# EasyEDA Pro project Trinity Flight Computer_2025-07-16.epro

# Schematic Trinity Schematic
Board Name: Board1; Create Date: 2025-04-18; Page Name: Main; Project Name: Trinity Flight Computer; Schematic Name: Trinity Schematic; Update Date: 2025-04-29; Company: Space Force; Drawn: Tadeáš Těhan; Page Size: A4; Version: V1.0
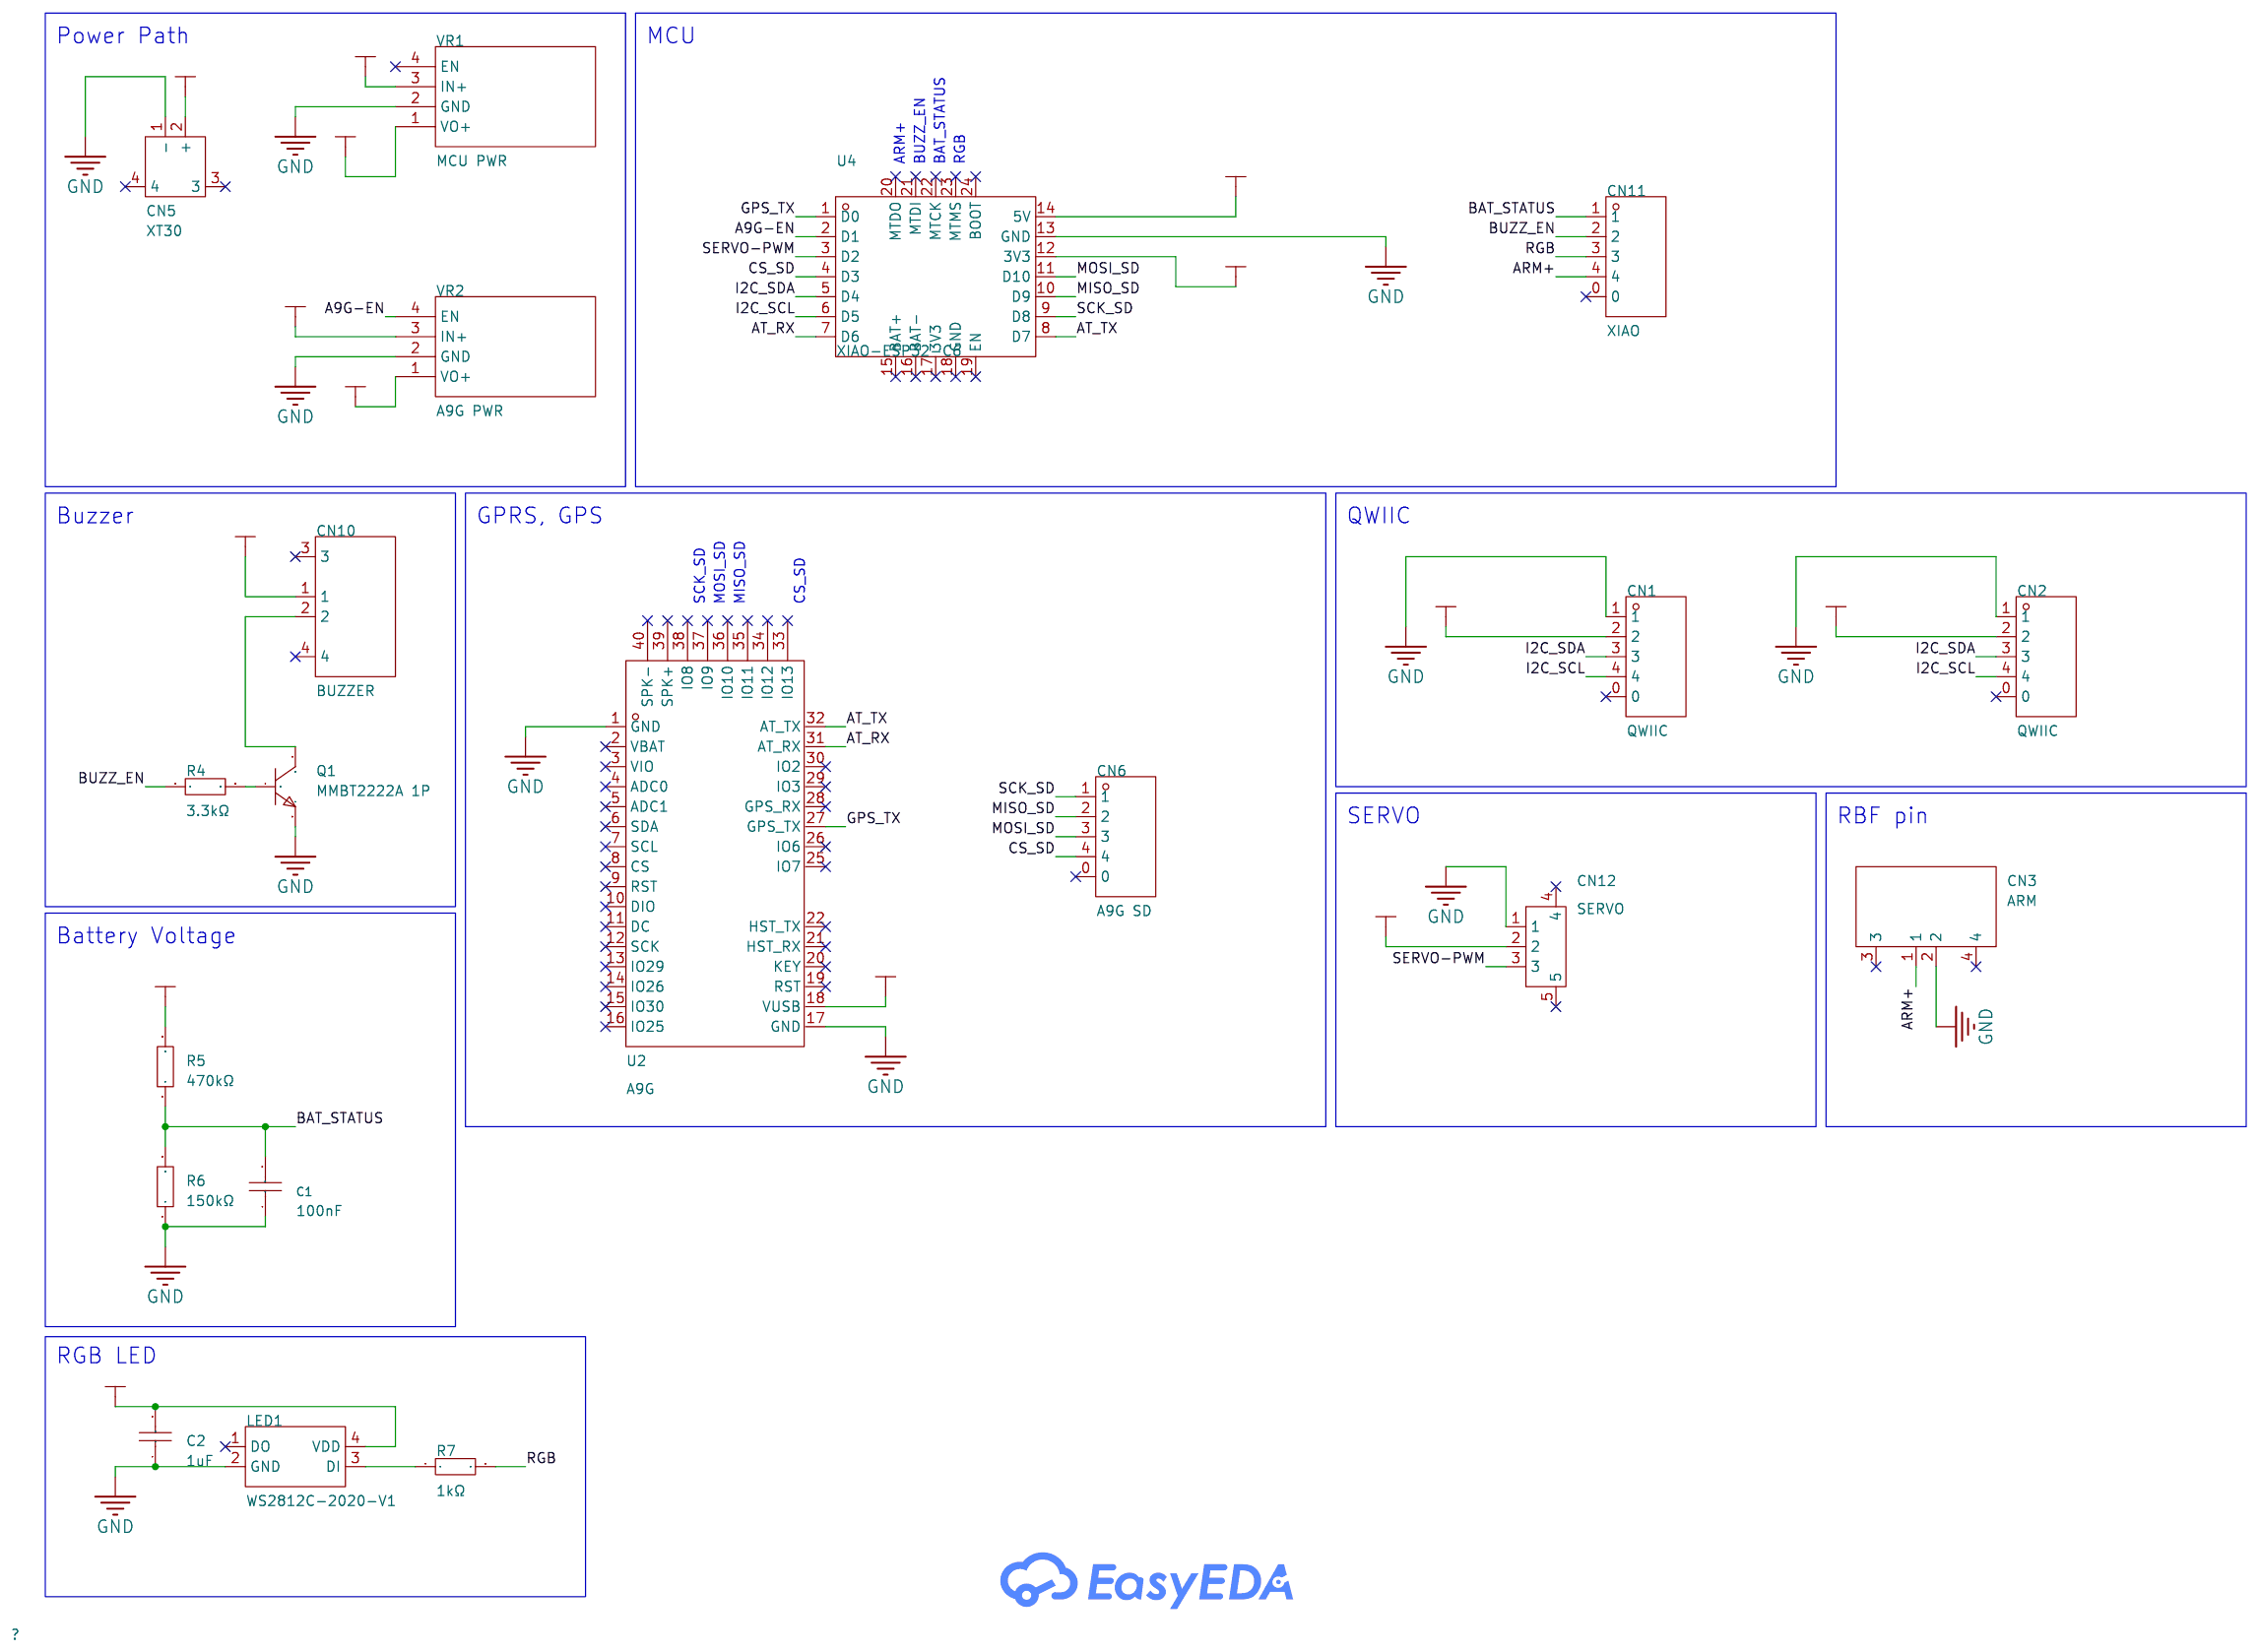
[diagram p0: schematic sheet]

## Parts
C1  100nF  [C0603]
C2  1uF  [C0603]
CN1  QWIIC  [CONN-SMD_BM04B-SRSS-TB]
CN2  QWIIC  [CONN-SMD_BM04B-SRSS-TB]
CN3  ARM  [CONN-TH_BM02B-SRSS-TB-LF-SN]
CN5  XT30  [CONN-TH_XT30PW-M]
CN6  A9G SD  [CONN-SMD_BM04B-SRSS-TB]
CN10  BUZZER  [CONN-TH_BM02B-SRSS-TB-LF-SN]
CN11  XIAO  [CONN-SMD_BM04B-SRSS-TB]
CN12  SERVO  [CONN-SMD_BM03B-SRSS-TBT-LF-SN]
LED1  WS2812C-2020-V1  [LED-SMD_4P-L2.0-W2.0-TL_WS2812B-2020]
Q1  MMBT2222A 1P  [SOT-23-3_L2.9-W1.3-P1.90-LS2.4-BR]
R4  3.3kΩ  [R0603]
R5  470kΩ  [R0603]
R6  150kΩ  [R0603]
R7  1kΩ  [R0603]
U2  A9G  [COMM-TH_A9G-MODULE]
U4  XIAO-ESP32-C6  [XIAO-ESP32-C6]
VR1  MCU PWR  [MP2315]
VR2  A9G PWR  [MP2315]

## Library data of the parts
C1 = 0603B104K250CT_C83054: Capacitance: Tolerance:±10% Tolerance:±10% Voltage Rated: Temperature Coefficient:; LCSC Part Name: 100nF ±10% 25V; Supplier Part: C83054; Manufacturer: Walsin(华新科); Manufacturer Part: 0603B104K250CT; Supplier Footprint: 0603; JLCPCB Part Class: Extended Part; Datasheet: https://atta.szlcsc.com/upload/public/pdf/source/20161123/1479873081754.pdf; Supplier: LCSC; Tolerance: ±10%
C2 = 0603B105K160CT: Capacitance: Tolerance:±10% Tolerance:±10% Voltage Rated: Temperature Coefficient:; LCSC Part Name: 1uF ±10% 16V; Supplier Part: C108463; Manufacturer: Walsin(华新科); Supplier Footprint: 0603; JLCPCB Part Class: Extended Part; Datasheet: https://atta.szlcsc.com/upload/public/pdf/source/20240116/5FE9141A208209FD572C22A50E54F9EC.pdf; Supplier: LCSC; Tolerance: ±10%
CN1 CN2 CN6 CN11 = BM04B-SRSS-TB(LF)(SN): Pins Structure:1x4P Pitch:1mm Mounting Style:Standing paste Reference Series:SH Number of Pins:4P Number of Rows:1 Number of PINs Per Row:4 Row Spacing:- Current Rating (Max):1A Contact Material:Copper alloy Contact Plating:Tin Operating Temperature Range; LCSC Part Name: 1x4P 间距:1mm 立贴 系列:SH; Supplier Part: C160390; Manufacturer: JST; Supplier Footprint: SMD,P=1mm; JLCPCB Part Class: Extended Part; Datasheet: https://atta.szlcsc.com/upload/public/pdf/source/20181008/C268118_5C0FE2784716D1E5DD0A36233D1E1F34.pdf; Supplier: LCSC; Pins Structure: 1x4P; Pitch: 1mm; Mounting Style: Standing paste; Reference Series: SH; Number of Pins: 4P; Number of Rows: 1; Number of PINs Per Row: 4; Current Rating (Max): 1A; Contact Material: Copper alloy; Contact Plating: Tin; Operating Temperature Range: -25℃~+85℃; Rated Voltage (Max): 50V; Plastic Material: PA; Flame Retardant Rating: UL94V-0; Supplementary Features: Auxiliary soldering legs; Colour: White; Z-Height of the Board: 4.25mm; X-Length of Bottom Edge on Board (Spacing Line): 6mm; Y-Width of Bottom Edge on Board: 3.6mm
CN3 CN10 = BM02B-SRSS-TB(LF)(SN): Pins Structure:1x2P Pitch:1mm Mounting Style:Brick nogging Reference Series:SH Number of Pins:2P Number of Rows:1 Number of PINs Per Row:2 Row Spacing:- Current Rating (Max):1A Contact Material:Copper Alloy Contact Plating:Tin Operating Temperature Range:; LCSC Part Name: 1x2P 间距:1mm 立贴 系列:SH; Supplier Part: C160388; Manufacturer: JST; Supplier Footprint: SMD,P=1mm; JLCPCB Part Class: Extended Part; Datasheet: https://atta.szlcsc.com/upload/public/pdf/source/20181008/C268118_5C0FE2784716D1E5DD0A36233D1E1F34.pdf; Supplier: LCSC; Pins Structure: 1x2P; Pitch: 1mm; Mounting Style: Brick nogging; Reference Series: SH; Number of Pins: 2P; Number of Rows: 1; Number of PINs Per Row: 2; Current Rating (Max): 1A; Contact Material: Copper Alloy; Contact Plating: Tin; Operating Temperature Range: -25℃~+85℃; Rated Voltage (Max): 50V; Plastic Material: PA; Flame Retardant Rating: UL94V-0; Supplementary Features: 辅助焊脚; Colour: White; Z-Height of the Board: 4.25mm; X-Length of Bottom Edge on Board (Spacing Line): 4mm; Y-Width of Bottom Edge on Board: 3.6mm
CN5 = XT30PW-M30.G.Y: Power:- Output:- Input:- Size:- Interface:- Type:- Colour:- MaximumCurrent:- Type:Aviation model plug RatedVoltage:DC 500V Type1:- NumberOfUSBHoles:- InterfaceType:Male head MetalMaterial:- InsulationMaterial:- RatedCurrent:15A RecommendedWireGauge:16/18/; LCSC Part Name: AMASS(艾迈斯)航模插头 卧式弯脚 XT30PW-M公头; Supplier Part: C431092; Manufacturer: AMASS(艾迈斯); JLCPCB Part Class: Extended Part; Datasheet: https://atta.szlcsc.com/upload/public/pdf/source/20220222/6A9F22F7850E25B33E1BE430ADF8560B.pdf; Supplier: LCSC; Type: Aviation model plug; RatedVoltage: DC 500V; InterfaceType: Male head; RatedCurrent: 15A; RecommendedWireGauge: 16/18/20AWG; contact resistance: 1.2mΩ; specifications: 2pin
CN12 = BM03B-SRSS-TBT(LF)(SN): Pins Structure:1x3P Pitch:1mm Mounting Style:Brick nogging Reference Series:SH Number of Pins:3P Number of Rows:1 Number of PINs Per Row:3 Row Spacing:- Current Rating (Max):1A Contact Material:Copper Alloy Contact Plating:Tin Operating Temperature Range:; LCSC Part Name: 1x3P 间距:1mm 立贴 系列:SH; Supplier Part: C495538; Manufacturer: JST; Supplier Footprint: SMD,P=1mm; JLCPCB Part Class: Extended Part; Datasheet: https://atta.szlcsc.com/upload/public/pdf/source/20200311/C495539_4B291EBEBD1ECED2F6F483F97D0425DB.pdf; Supplier: LCSC; Pins Structure: 1x3P; Pitch: 1mm; Mounting Style: Brick nogging; Reference Series: SH; Number of Pins: 3P; Number of Rows: 1; Number of PINs Per Row: 3; Current Rating (Max): 1A; Contact Material: Copper Alloy; Contact Plating: Tin; Operating Temperature Range: -25℃~+85℃; Rated Voltage (Max): 50V; Plastic Material: PA; Flame Retardant Rating: UL94V-0; Supplementary Features: 辅助焊脚; Colour: White; Z-Height of the Board: 4.25mm; X-Length of Bottom Edge on Board (Spacing Line): 5mm; Y-Width of Bottom Edge on Board: 3.6mm
LED1 = WS2812C-2020-V1: LCSC Part Name: RGB三色; Supplier Part: C2976072; Manufacturer: worldsemi; Supplier Footprint: SMD,2x2mm; JLCPCB Part Class: Extended Part; Datasheet: https://atta.szlcsc.com/upload/public/pdf/source/20220222/52A01000447F5320C9A8C3F34CEFDB81.pdf; Supplier: LCSC
Q1 = MMBT2222A 1P: type:NPN Current - Collector(Ic): Collector - Emitter Voltage VCEO:40V Pd - Power Dissipation:300mW DC Current Gain:100@150mA,10V DC Current Gain:100@150mA,10V Transition frequency(fT):300MHz Current - Collector Cutoff:10nA Vce Saturation(VCE(sat)):- Oper; LCSC Part Name: 丝印1P; Supplier Part: C8512; Manufacturer: CJ(江苏长电/长晶); Supplier Footprint: SOT-23; JLCPCB Part Class: Basic Part; Datasheet: https://atta.szlcsc.com/upload/public/pdf/source/20140815/1457707223705.pdf; Supplier: LCSC; type: NPN; Collector - Emitter Voltage VCEO: 40V; Pd - Power Dissipation: 300mW; DC Current Gain: 100@150mA,10V; Transition frequency(fT): 300MHz; Current - Collector Cutoff: 10nA; Operating Temperature: -55℃~+150℃
R4 = WR06X332JTL: Type:Thick Film Resistors Resistance: Tolerance:±5% Tolerance:±5% Power(Watts): Overload Voltage (Max): Temperature Coefficient:±100ppm/℃ Temperature Coefficient:±100ppm/℃ Operating Temperature Range:-55℃~+155℃ Operating Temperature Range:-55℃~+155℃; LCSC Part Name: 厚膜电阻 3.3kΩ ±5% 100mW; Supplier Part: C192124; Manufacturer: Walsin(华新科); Supplier Footprint: 0603; JLCPCB Part Class: Extended Part; Datasheet: https://atta.szlcsc.com/upload/public/pdf/source/20191217/C470037_D99261402F77DA8B1D609223749D445A.pdf; Supplier: LCSC; Type: Thick Film Resistors; Tolerance: ±5%; Temperature Coefficient: ±100ppm/℃; Operating Temperature Range: -55℃~+155℃
R5 = WR06X4703FTL: Type:Thick Film Resistors Resistance: Tolerance:±1% Tolerance:±1% Power(Watts): Temperature Coefficient:±100ppm/℃ Temperature Coefficient:±100ppm/℃ Operating Temperature Range:-55℃~+155℃ Operating Temperature Range:-55℃~+155℃; LCSC Part Name: 厚膜电阻 470kΩ ±1% 100mW; Supplier Part: C163919; Manufacturer: Walsin(华新科); Supplier Footprint: 0603; JLCPCB Part Class: Extended Part; Datasheet: https://atta.szlcsc.com/upload/public/pdf/source/20191217/C470037_D99261402F77DA8B1D609223749D445A.pdf; Supplier: LCSC; Type: Thick Film Resistors; Tolerance: ±1%; Temperature Coefficient: ±100ppm/℃; Operating Temperature Range: -55℃~+155℃
R6 = WR06X1503FTL: Type:Thick Film Resistors Resistance: Tolerance:±1% Tolerance:±1% Power(Watts): Overload Voltage (Max): Temperature Coefficient:±100ppm/℃ Temperature Coefficient:±100ppm/℃ Operating Temperature Range:-55℃~+155℃ Operating Temperature Range:-55℃~+155℃; LCSC Part Name: 厚膜电阻 150kΩ ±1% 100mW; Supplier Part: C163861; Manufacturer: Walsin(华新科); Supplier Footprint: 0603; JLCPCB Part Class: Extended Part; Datasheet: https://atta.szlcsc.com/upload/public/pdf/source/20191217/C470037_D99261402F77DA8B1D609223749D445A.pdf; Supplier: LCSC; Type: Thick Film Resistors; Tolerance: ±1%; Temperature Coefficient: ±100ppm/℃; Operating Temperature Range: -55℃~+155℃
R7 = WR06X1001FTL: Type:Thick Film Resistors Resistance: Tolerance:±1% Tolerance:±1% Power(Watts): Overload Voltage (Max): Temperature Coefficient:±100ppm/℃ Temperature Coefficient:±100ppm/℃ Operating Temperature Range:-55℃~+155℃ Operating Temperature Range:-55℃~+155℃; LCSC Part Name: 厚膜电阻 1kΩ ±1% 100mW; Supplier Part: C112433; Manufacturer: Walsin(华新科); Supplier Footprint: 0603; JLCPCB Part Class: Extended Part; Datasheet: https://atta.szlcsc.com/upload/public/pdf/source/20191217/C470037_D99261402F77DA8B1D609223749D445A.pdf; Supplier: LCSC; Type: Thick Film Resistors; Tolerance: ±1%; Temperature Coefficient: ±100ppm/℃; Operating Temperature Range: -55℃~+155℃
U2 = A9G Pudding Dev Module Headers Extended: CPU:- ROM Size:- Number of I/O: USB:- WIFI Protocols:- Bluetooth:- Ethernet:- Audio & Video Interface:- Multimedia Support:- Card Type:- Power Supply Type:- Power Supply:- POE Support:- Resolution:- Temperature Range:-; Supplier Part: C191953; Manufacturer: Ai-Thinker; Supplier: LCSC
U4 = XIAO-ESP32-C6 Headers Extended: The Seeed Studio XIAO ESP32C6 is an ultra-compact microcontroller module powered by Espressif’s ESP32-C6 SoC. It features dual 32-bit RISC-V processors—a high-performance core running up to 160 MHz and a low-power core up to 20 MHz.
VR1 VR2 = MP2315: high quality step down power converter with an efficiency of 97.5% at 6.5v to 5V at 0.7A and relatively little heat development. The efficiency is 94% at 12V to 5V at 1A. / Power supply 4.5v to 24v; link: https://www.laskakit.cz/mikro-step-down-menic--nastavitelny/

## Nets
3V3: CN1.2 CN2.2 U4.12(3V3)
5VA: U2.18(VUSB) VR2.1(VO+)
5VM: C2.2 CN12.2 LED1.4(VDD) U4.14(5V) VR1.1(VO+)
7V4: CN5.2(+) CN10.1 R5.2 VR1.3(IN+) VR2.3(IN+)
GND: C1.1 C2.1 CN1.1 CN2.1 CN3.2 CN5.1(-) CN12.1 LED1.2(GND) Q1.2(E) R6.1 U2.1(GND) U2.17(GND) U4.13(GND) VR1.2(GND) VR2.2(GND)
A9G-EN: U4.2(D1) VR2.4(EN)
ARM+: CN3.1 CN11.4
AT_RX: U2.31(AT_RX) U4.7(D6)
AT_TX: U2.32(AT_TX) U4.8(D7)
BAT_STATUS: C1.2 CN11.1 R5.1 R6.2
BUZZ_EN: CN11.2 R4.1
CS_SD: CN6.4 U4.4(D3)
GPS_TX: U2.27(GPS_TX) U4.1(D0)
I2C_SCL: CN1.4 CN2.4 U4.6(D5)
I2C_SDA: CN1.3 CN2.3 U4.5(D4)
MISO_SD: CN6.2 U4.10(D9)
MOSI_SD: CN6.3 U4.11(D10)
RGB: CN11.3 R7.2
SCK_SD: CN6.1 U4.9(D8)
SERVO-PWM: CN12.3 U4.3(D2)
$1N5609: Q1.1(B) R4.2
$1N5742: CN10.2 Q1.3(C)
$1N11221: LED1.3(DI) R7.1

Not connected (* = marked no-connect by the designer): CN1 0*; CN2 0*; CN3 3* 4*; CN5 3* 4*; CN6 0*; CN10 3* 4*; CN11 0*; CN12 4* 5*; LED1 1(DO)*; U2 2(VBAT)* 3(VIO)* 4(ADC0)* 5(ADC1)* 6(SDA)* 7(SCL)* 8(CS)* 9(RST)* 10(DIO)* 11(DC)* 12(SCK)* 13(IO29)* 14(IO26)* 15(IO30)* 16(IO25)* 19(RST)* 20(KEY)* 21(HST_RX)* 22(HST_TX)* 25(IO7)* 26(IO6)* 28(GPS_RX)* 29(IO3)* 30(IO2)* 33(IO13)* 34(IO12)* 35(IO11)* 36(IO10)* 37(IO9)* 38(IO8)* 39(SPK+)* 40(SPK-)*; U4 15(BAT+)* 16(BAT-)* 17(3V3)* 18(GND)* 19(EN)* 20(MTDO)* 21(MTDI)* 22(MTCK)* 23(MTMS)* 24(BOOT)*; VR1 4(EN)*

## Notes on the sheet
- Power Path
- MCU
- ARM+
- BUZZ_EN
- BAT_STATUS
- RGB
- Buzzer
- GPRS, GPS
- QWIIC
- SCK_SD
- MOSI_SD
- MISO_SD
- CS_SD
- SERVO
- RBF pin
- Battery Voltage
- RGB LED

# Board Trinity Avionics PCB
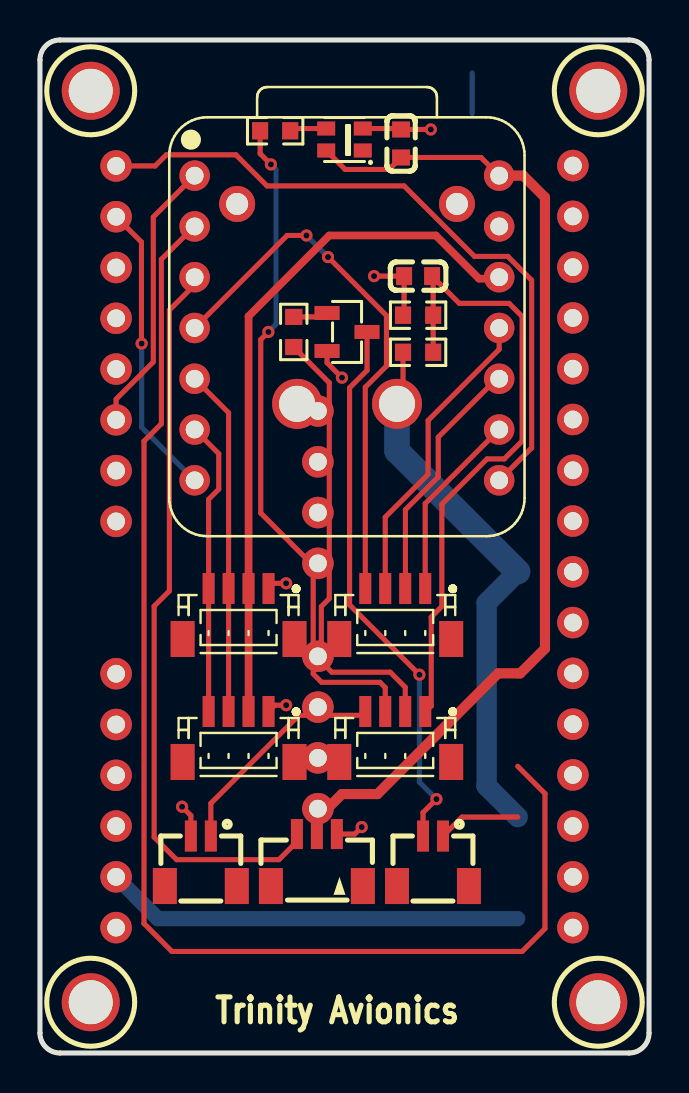
[diagram p1: board, top side]
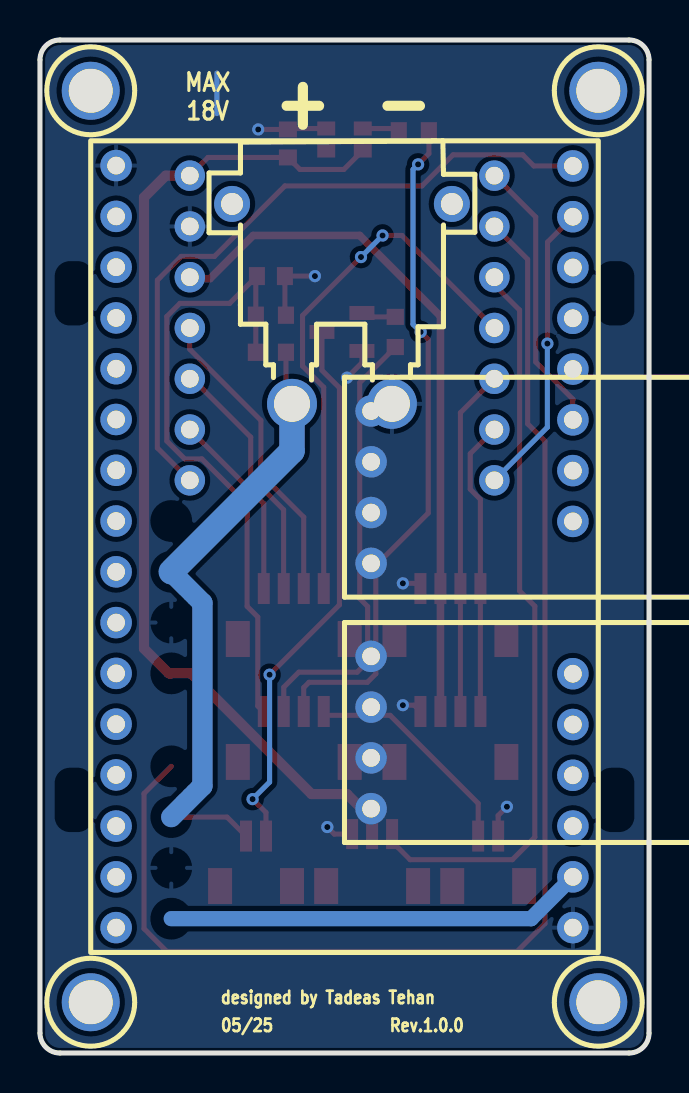
[diagram p2: board, bottom side, seen from below]

Outline 30.48 x 50.67 mm; copper layers: Top Layer, Bottom Layer. Coordinates in mm from the lower left corner of the outline.
Outline path: 0,49.67 0,1 arc(0.29,0.29) 1,0 29.48,0 arc(30.19,0.29) 30.48,1 30.48,49.67 arc(30.19,50.38) 29.48,50.67 1,50.67 arc(0.29,50.38) 0,49.67
Stack: Top Layer 0.035mm / Dielectric1 1.51mm FR4 er 4.5 / Bottom Layer 0.035mm

## Design rules (mm)
template: JLCPCB Capability(Two Layers Board)
spacing copperThickness1oz (default): track to track 0.102, other pairs 0.152 to 0.3
spacing copperThickness2oz: track to track 0.203, other pairs 0.152 to 0.3
track width copperThickness1oz (default): min 0.127, default 0.254, max 2.54
track width copperThickness2oz: min 0.203, default 0.254, max 2.54
differential pair differentialPair (default): width min 0.127, default 0.254, max 2.54; gap min 0.152, default 0.152
via viaSize (default): diameter min 0.5, default 0.61, max 10; hole min 0.3, default 0.305, max 6.3

## Placement (name value [footprint] x y rotation side)
C1  100nF  [C0603]  18.92 38.86 0 top
C2  1uF  [C0603]  18.07 45.5 270 top
CN1  QWIIC  [CONN-SMD_BM04B-SRSS-TB]  9.94 21.97 180 top
CN2  QWIIC  [CONN-SMD_BM04B-SRSS-TB]  9.94 15.82 180 top
CN3  ARM  [CONN-TH_BM02B-SRSS-TB-LF-SN]  8.05 9.6 0 top
CN5  XT30  [CONN-TH_XT30PW-M]  15.37 37.47 0 bottom
CN6  A9G SD  [CONN-SMD_BM04B-SRSS-TB]  17.78 21.97 180 top
CN10  BUZZER  [CONN-TH_BM02B-SRSS-TB-LF-SN]  19.67 9.6 0 top
CN11  XIAO  [CONN-SMD_BM04B-SRSS-TB]  17.78 15.82 180 top
CN12  SERVO  [CONN-SMD_BM03B-SRSS-TBT-LF-SN]  13.86 9.65 0 top
LED1  WS2812C-2020-V1  [LED-SMD_4P-L2.0-W2.0-TL_WS2812B-2020]  15.24 45.69 180 top
NOREF  -  [Pad_e3089]  2.54 48.13 0 top
NOREF#2  -  [Pad_e3090]  27.94 48.13 0 top
NOREF#3  -  [Pad_e3092]  2.54 2.54 0 top
NOREF#4  -  [Pad_e3091]  27.94 2.54 0 top
Q1  MMBT2222A 1P  [SOT-23-3_L2.9-W1.3-P1.90-LS2.4-BR]  15.37 36.07 180 top
R4  3.3kΩ  [R0603]  12.7 36.07 90 top
R5  470kΩ  [R0603]  18.92 35.05 180 top
R6  150kΩ  [R0603]  18.92 36.91 0 top
R7  1kΩ  [R0603]  11.77 46.13 180 top
U2  A9G  [COMM-TH_A9G-MODULE]  15.24 25.33 180 bottom
U4  -  [XIAO-ESP32-C6]  15.24 36.89 0 top
VR1  MCU PWR  [MP2315]  15.24 22.8 90 bottom
VR2  A9G PWR  [MP2315]  15.24 10.53 90 bottom

## Footprints (pads in the part's own frame, mm; a bottom-side part is the same pattern mirrored in y, then rotated)
C0603
  rect 0.8x0.9 smd: 1(-0.7,0) 2(0.7,0)
COMM-TH_A9G-MODULE
  round 1.575 hole 0.889: 1(-11.43,19.059) 2(-11.43,16.519) 3(-11.43,13.979) 4(-11.43,11.439) 5(-11.43,8.899) 6(-11.43,6.359) 7(-11.43,3.819) 8(-11.43,1.279) 9(-11.43,-1.261) 10(-11.43,-3.801) 11(-11.43,-6.341) 12(-11.43,-8.881) 13(-11.43,-11.421) 14(-11.43,-13.979) 15(-11.43,-16.519) 16(-11.43,-19.059) 17(11.43,-19.059) 18(11.43,-16.519) 19(11.43,-13.979) 20(11.43,-11.439) 21(11.43,-8.899) 22(11.43,-6.359) 25(11.43,1.261) 26(11.43,3.801) 27(11.43,6.341) 28(11.43,8.881) 29(11.43,11.421) 30(11.43,13.961) 31(11.43,16.501) 32(11.43,19.041)
CONN-SMD_BM03B-SRSS-TBT-LF-SN
  rect 0.6x1.5 smd: 1(1,1.3) 2(0,1.3) 3(-1,1.3)
  rect 1.2x1.8 smd: 4(-2.3,-1.3) 5(2.3,-1.3)
CONN-SMD_BM04B-SRSS-TB
  rect 1.2x1.8 smd: 0(-2.8,1.262) 0(2.8,1.262)
  rect 0.6x1.55 smd: 1(-1.5,-1.262) 2(-0.5,-1.262) 3(0.5,-1.262) 4(1.5,-1.262)
CONN-TH_BM02B-SRSS-TB-LF-SN
  rect 0.6x1.55 smd: 1(0.502,1.25) 2(-0.498,1.25)
  rect 1.2x1.8 smd: 3(1.8,-1.25) 4(-1.8,-1.25)
CONN-TH_XT30PW-M
  round 2.5 hole 1.8: 1(-2.5,5) 2(2.5,5)
  round 1.8 hole 1.1: 3(5.5,-5) 4(-5.5,-5)
LED-SMD_4P-L2.0-W2.0-TL_WS2812B-2020
  rect 0.9x0.7 smd: 1(-0.915,0.55) 2(-0.915,-0.55) 3(0.915,-0.55) 4(0.915,0.55)
MP2315
  round 1.575 hole 0.889: 1(1.69,-1.331) 2(4.23,-1.331) 3(6.77,-1.331) 4(9.31,-1.331)
Pad_e3089
  round 2.9 hole 2.2: 1(0,0)
Pad_e3090
  round 2.9 hole 2.2: 1(0,0)
Pad_e3091
  round 2.9 hole 2.2: 1(0,0)
Pad_e3092
  round 2.9 hole 2.2: 1(0,0)
R0603
  rect 0.806x0.864 smd: 1(-0.753,0) 2(0.753,0)
SOT-23-3_L2.9-W1.3-P1.90-LS2.4-BR
  rect 1.25x0.7 smd: 1(1,-0.95) 2(1,0.95) 3(-1,0)
XIAO-ESP32-C6
  round 1.524 hole 0.889: 1(-7.5,6.999) 2(-7.5,4.459) 3(-7.5,1.919) 4(-7.5,-0.621) 5(-7.5,-3.161) 6(-7.5,-5.701) 7(-7.5,-8.241) 8(7.74,-8.241) 9(7.74,-5.701) 10(7.74,-3.161) 11(7.74,-0.621) 12(7.74,1.919) 13(7.74,4.459) 14(7.74,6.999)

## Nets
As in the schematic.

Pads without a net: CN1 0; CN2 0; CN3 3 4; CN5 3 4; CN6 0; CN10 3 4; CN11 0; CN12 4 5; LED1 1; NOREF 1; NOREF#2 1; NOREF#3 1; NOREF#4 1; U2 2 3 4 5 6 7 8 9 10 11 12 13 14 15 16 19 20 21 22 25 26 28 29 30; VR1 4

## Via types
v1: diameter 0.61, hole 0.305, Top Layer to Bottom Layer, 14 vias

## Routing (per net, layer and track width the routed paths; a pad name or vN(x,y) marks a point on that pad's centre or on a via; arc(x,y) is an arc through that point)
3V3: length 34.9
  Top Layer w0.381: CN2.2 CN1.2 10.44,36.86 14.48,40.89 19.81,40.89 21.97,38.74 22.91,38.74 U4.12
5VA: length 21
  Bottom Layer w0.762: U2.18 5.9,6.72 23.91,6.72
5VM: length 50.7
  Top Layer w0.254: U4.14 22.07,44.8 C2.2 17.47,44.2 15.27,44.2 LED1.4
  Top Layer w0.508: CN12.2 13.86,11.7 15.11,12.95 16.89,12.95 22.93,18.99 24.04,18.99 25.27,20.23 25.27,42.8 24.19,43.89 U4.14
7V4: length 31.3
  Top Layer w0.254: 20.17,10.85 21.12,11.8 23.91,11.8 ; R5.2 18.17,32.77 CN5.2
  Bottom Layer w1.016: 23.91,24.07 22.35,22.52 22.35,13.36 23.91,11.8
  Bottom Layer w1.27: CN5.2 17.87,30.11 23.91,24.07
GND: length 15.6
  Top Layer w0.254: CN1.1 11.7,23.5 v1(12.32,23.5) ; v1(15.11,33.78) 14.37,34.53 Q1.2 ; v1(16.72,38.86) C1.1 18.22,36.96 R6.1 ; v1(7.11,12.32) 7.55,11.88 CN3.2 ; v1(19.56,46.2) C2.1 18.02,46.24 LED1.2 ; v1(16.1,11.3) 15.75,10.95 CN12.1 ; CN2.1 11.75,17.4 v1(12.32,17.4)
  Bottom Layer w0.254: 21.63,49.02 21.63,46.99
A9G-EN: length 65.7
  Top Layer w0.254: U4.2 7.72,41.35 6.08,39.7 6.08,31.48 5.21,30.61 5.21,6.48 6.6,5.08 24.13,5.08 25.27,6.22 25.27,12.98 23.91,14.34
ARM+: length 11.3
  Top Layer w0.254: CN3.1 8.55,12.49 12.95,16.89 16.09,16.89 CN11.4
AT_RX: length 14.8
  Top Layer w0.254: v1(5.09,35.49) 5.08,35.49 5.08,40.56 U2.31
  Bottom Layer w0.254: v1(5.09,35.49) 5.09,31.3 U4.7
AT_TX: length 34.3
  Top Layer w0.254: 24.6,38.66 23.41,39.85 21.75,39.85 18.22,43.37 11.36,43.37 9.81,44.93 6.32,44.93 5.76,44.37 U2.32 ; 24.61,38.66 24.61,30.26 ; 24.6,30.26 U4.8
BAT_STATUS: length 31.4
  Top Layer w0.254: 19.68,38.81 R6.2 R5.1 ; 19.68,38.81 19.62,38.86 ; 19.68,38.81 20.99,37.5 23.48,37.5 24.13,36.84 24.13,30.61 23.24,29.72 22.38,29.72 20.11,27.46 20.11,22.34 19.58,21.81 19.58,17.36 19.31,17.08 CN11.1
BUZZ_EN: length 22.6
  Top Layer w0.254: R4.1 12.7,35.31 14.48,33.53 14.48,22.73 14.08,22.34 14.08,19.57 14.61,19.05 17.53,19.05 18.28,18.3 CN11.2
CS_SD: length 27.3
  Top Layer w0.254: v1(14.41,39.81) 17.34,36.89 17.34,34.36 16.28,33.3 CN6.4 ; U4.4 12.37,40.89 v1(13.34,40.89)
  Bottom Layer w0.254: v1(14.41,39.81) v1(13.34,40.89)
GPS_TX: length 13.8
  Top Layer w0.254: U4.1 5.67,41.82 5.67,34.57 3.81,32.7 U2.27
I2C_SCL: length 14.8
  Top Layer w0.254: U4.6 8.95,29.98 8.95,28.2 8.44,27.69 CN1.4 CN2.4
I2C_SDA: length 17.3
  Top Layer w0.254: CN2.3 CN1.3 9.44,32.03 U4.5
MISO_SD: length 12.5
  Top Layer w0.254: CN6.2 18.29,23.24 18.29,27.18 19.93,28.82 19.93,30.81 22.85,33.73 U4.10
MOSI_SD: length 15.4
  Top Layer w0.254: U4.11 22.98,35.2 19.42,31.64 19.42,28.95 17.28,26.81 CN6.3
RGB: length 34
  Top Layer w0.254: v1(11.43,36.07) 11.05,35.69 11.05,27.01 13.67,24.38 13.67,18.97 14.1,18.54 17.02,18.54 17.28,18.28 CN11.3 ; R7.2 11.02,44.99 v1(11.56,44.45)
  Bottom Layer w0.254: v1(11.43,36.07) 11.81,36.45 11.81,44.2 v1(11.56,44.45)
SCK_SD: length 9.5
  Top Layer w0.254: CN6.1 19.28,27.49 U4.9
SERVO-PWM: length 37.2
  Top Layer w0.254: U4.3 7.61,38.68 7.61,38.3 6.48,37.16 6.48,23.11 5.72,22.35 5.72,10.8 6.84,9.67 11.96,9.67 12.73,10.44 12.73,10.83 CN12.3
$1N5609: length 1.7
  Top Layer w0.254: R4.2 14.17,36.82 Q1.1
$1N5742: length 27.7
  Top Layer w0.254: 19.17,10.85 19.17,12.03 v1(19.84,12.7) ; Q1.3 16.37,34.15 15.49,33.27 15.49,22.42 v1(18.99,18.92)
  Bottom Layer w0.254: v1(19.84,12.7) 18.99,13.55 v1(18.99,18.92)
$1N11221: length 1.8
  Top Layer w0.254: LED1.3 12.64,46.24 R7.1

## Copper pours and planes (outline as drawn; the poured copper is in the pictures)
GND on Bottom Layer: -2.29,55.25 33.4,55.25 33.4,-3.05 -2.29,-3.05

## Text on the board
Bottom Silkscreen Layer: Rev.1.0.0 | 05/25 | designed by Tadeas Tehan | MAX / 18V | - | +
Top Silkscreen Layer: Trinity Avionics
